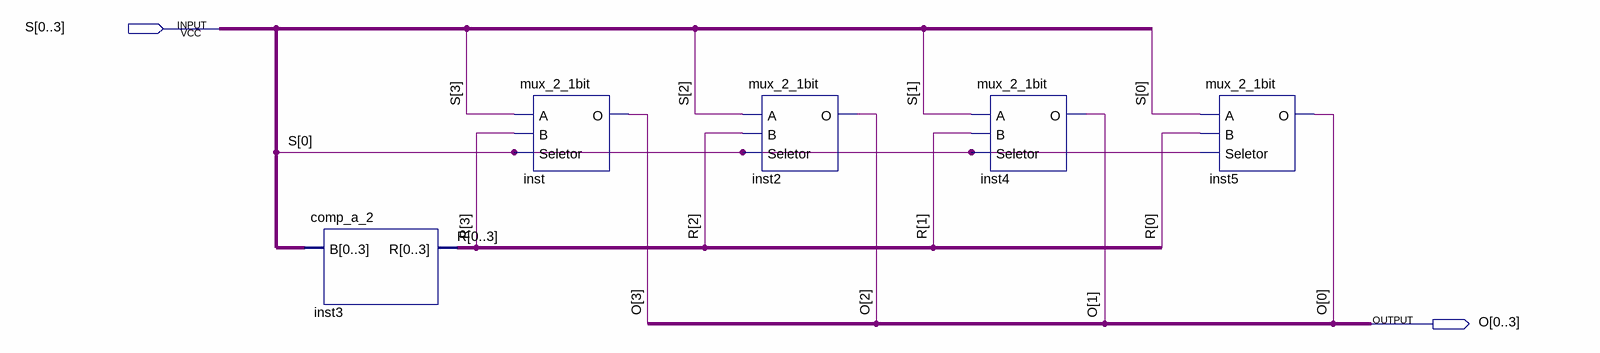
[diagram p0: schematic sheet]
// Quartus schematic mux_4bit_comp2.bdf as structural Verilog: 5 symbols, 2 pins
module mux_4bit_comp2 (
  input  [0:3] S,
  output [0:3] O
);

  wire [3:0] R;

  comp_a_2 inst3 (.B(S), .R({R[0], R[1], R[2], R[3]}));
  mux_2_1bit inst (.A(S[3]), .B(R[3]), .Seletor(S[0]), .O(O[3]));
  mux_2_1bit inst2 (.A(S[2]), .B(R[2]), .Seletor(S[0]), .O(O[2]));
  mux_2_1bit inst4 (.A(S[1]), .B(R[1]), .Seletor(S[0]), .O(O[1]));
  mux_2_1bit inst5 (.A(S[0]), .B(R[0]), .Seletor(S[0]), .O(O[0]));
endmodule
